# EAGLE design hexagon (EAGLE 9.4.0)

## Sheet 1 of 3: LEDs
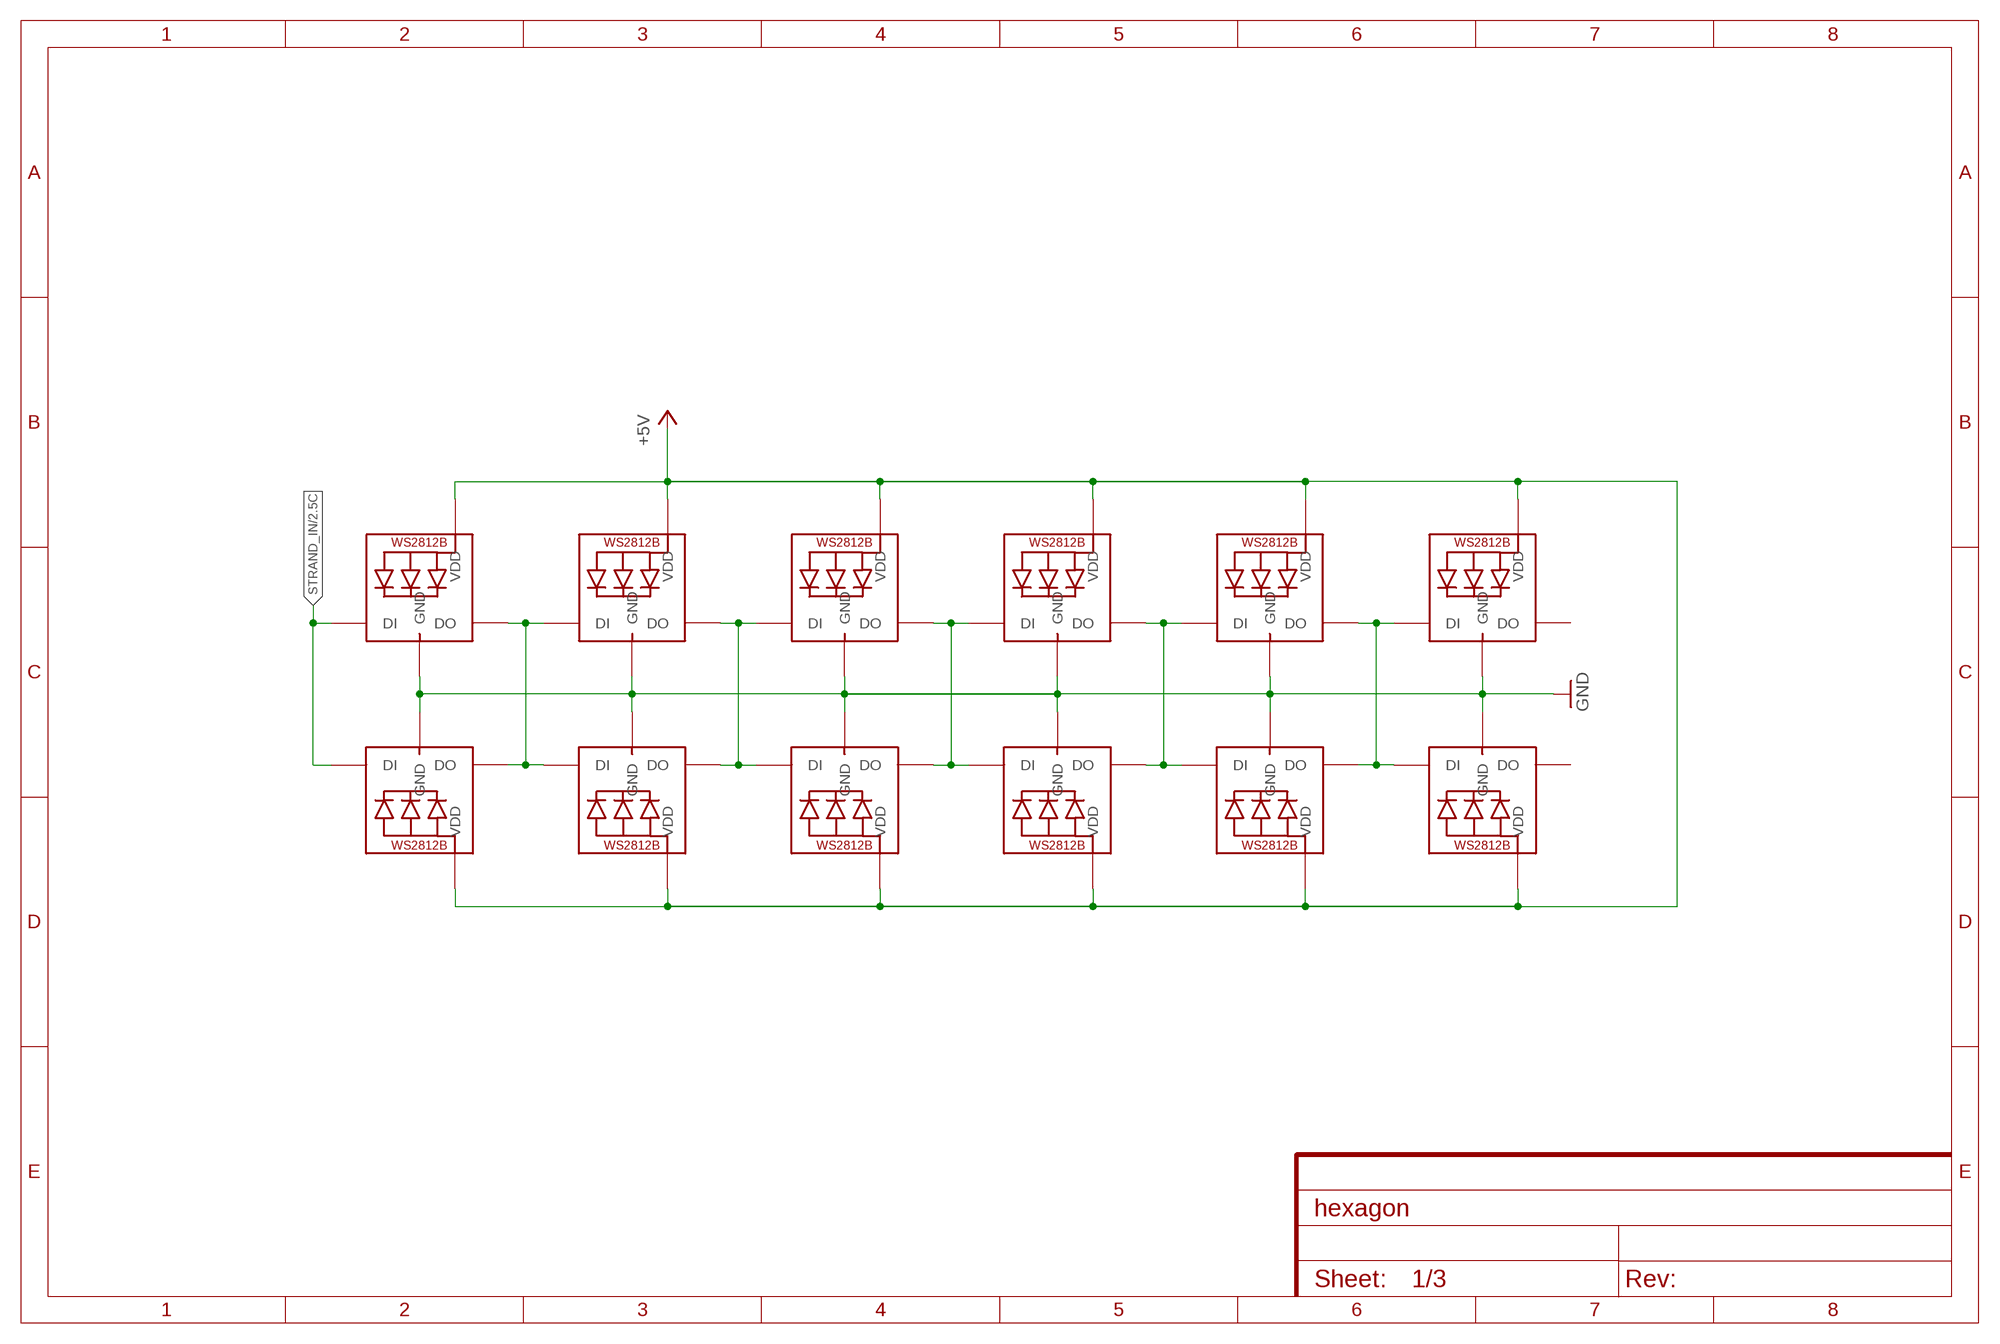
[diagram p0: schematic, sheet 1]

### Parts
LED1  WS2812B5050  [WS2812B]
LED2  WS2812B5050  [WS2812B]
LED3  WS2812B5050  [WS2812B]
LED4  WS2812B5050  [WS2812B]
LED5  WS2812B5050  [WS2812B]
LED6  WS2812B5050  [WS2812B]
LED7  WS2812B3535  [LED3535]
LED8  WS2812B3535  [LED3535]
LED9  WS2812B3535  [LED3535]
LED10  WS2812B3535  [LED3535]
LED11  WS2812B3535  [LED3535]
LED12  WS2812B3535  [LED3535]

### Nets
+5V [power usb]: LED1.1-VDD(VDD) LED2.1-VDD(VDD) LED3.1-VDD(VDD) LED4.1-VDD(VDD) LED5.1-VDD(VDD) LED6.1-VDD(VDD) LED7.2(VDD) LED8.2(VDD) LED9.2(VDD) LED10.2(VDD) LED11.2(VDD) LED12.2(VDD) ; also sheet 2,3
GND: LED1.3-GND(GND) LED2.3-GND(GND) LED3.3-GND(GND) LED4.3-GND(GND) LED5.3-GND(GND) LED6.3-GND(GND) LED7.4(GND) LED8.4(GND) LED9.4(GND) LED10.4(GND) LED11.4(GND) LED12.4(GND) ; also sheet 2,3
N$1: LED1.4-DIN(DI) LED6.2-DOUT(DO) LED7.1(DI) LED12.3(DO)
N$6: LED2.2-DOUT(DO) LED3.4-DIN(DI) LED8.3(DO) LED9.1(DI)
N$8: LED3.2-DOUT(DO) LED4.4-DIN(DI) LED9.3(DO) LED10.1(DI)
N$10: LED4.2-DOUT(DO) LED5.4-DIN(DI) LED10.3(DO) LED11.1(DI)
N$12: LED5.2-DOUT(DO) LED6.4-DIN(DI) LED11.3(DO) LED12.1(DI)
STRAND_IN: LED2.4-DIN(DI) LED8.1(DI) ; also sheet 2
Unconnected: LED1.2-DOUT(DO) LED7.3(DO)

## Sheet 2 of 3: Microcontroller
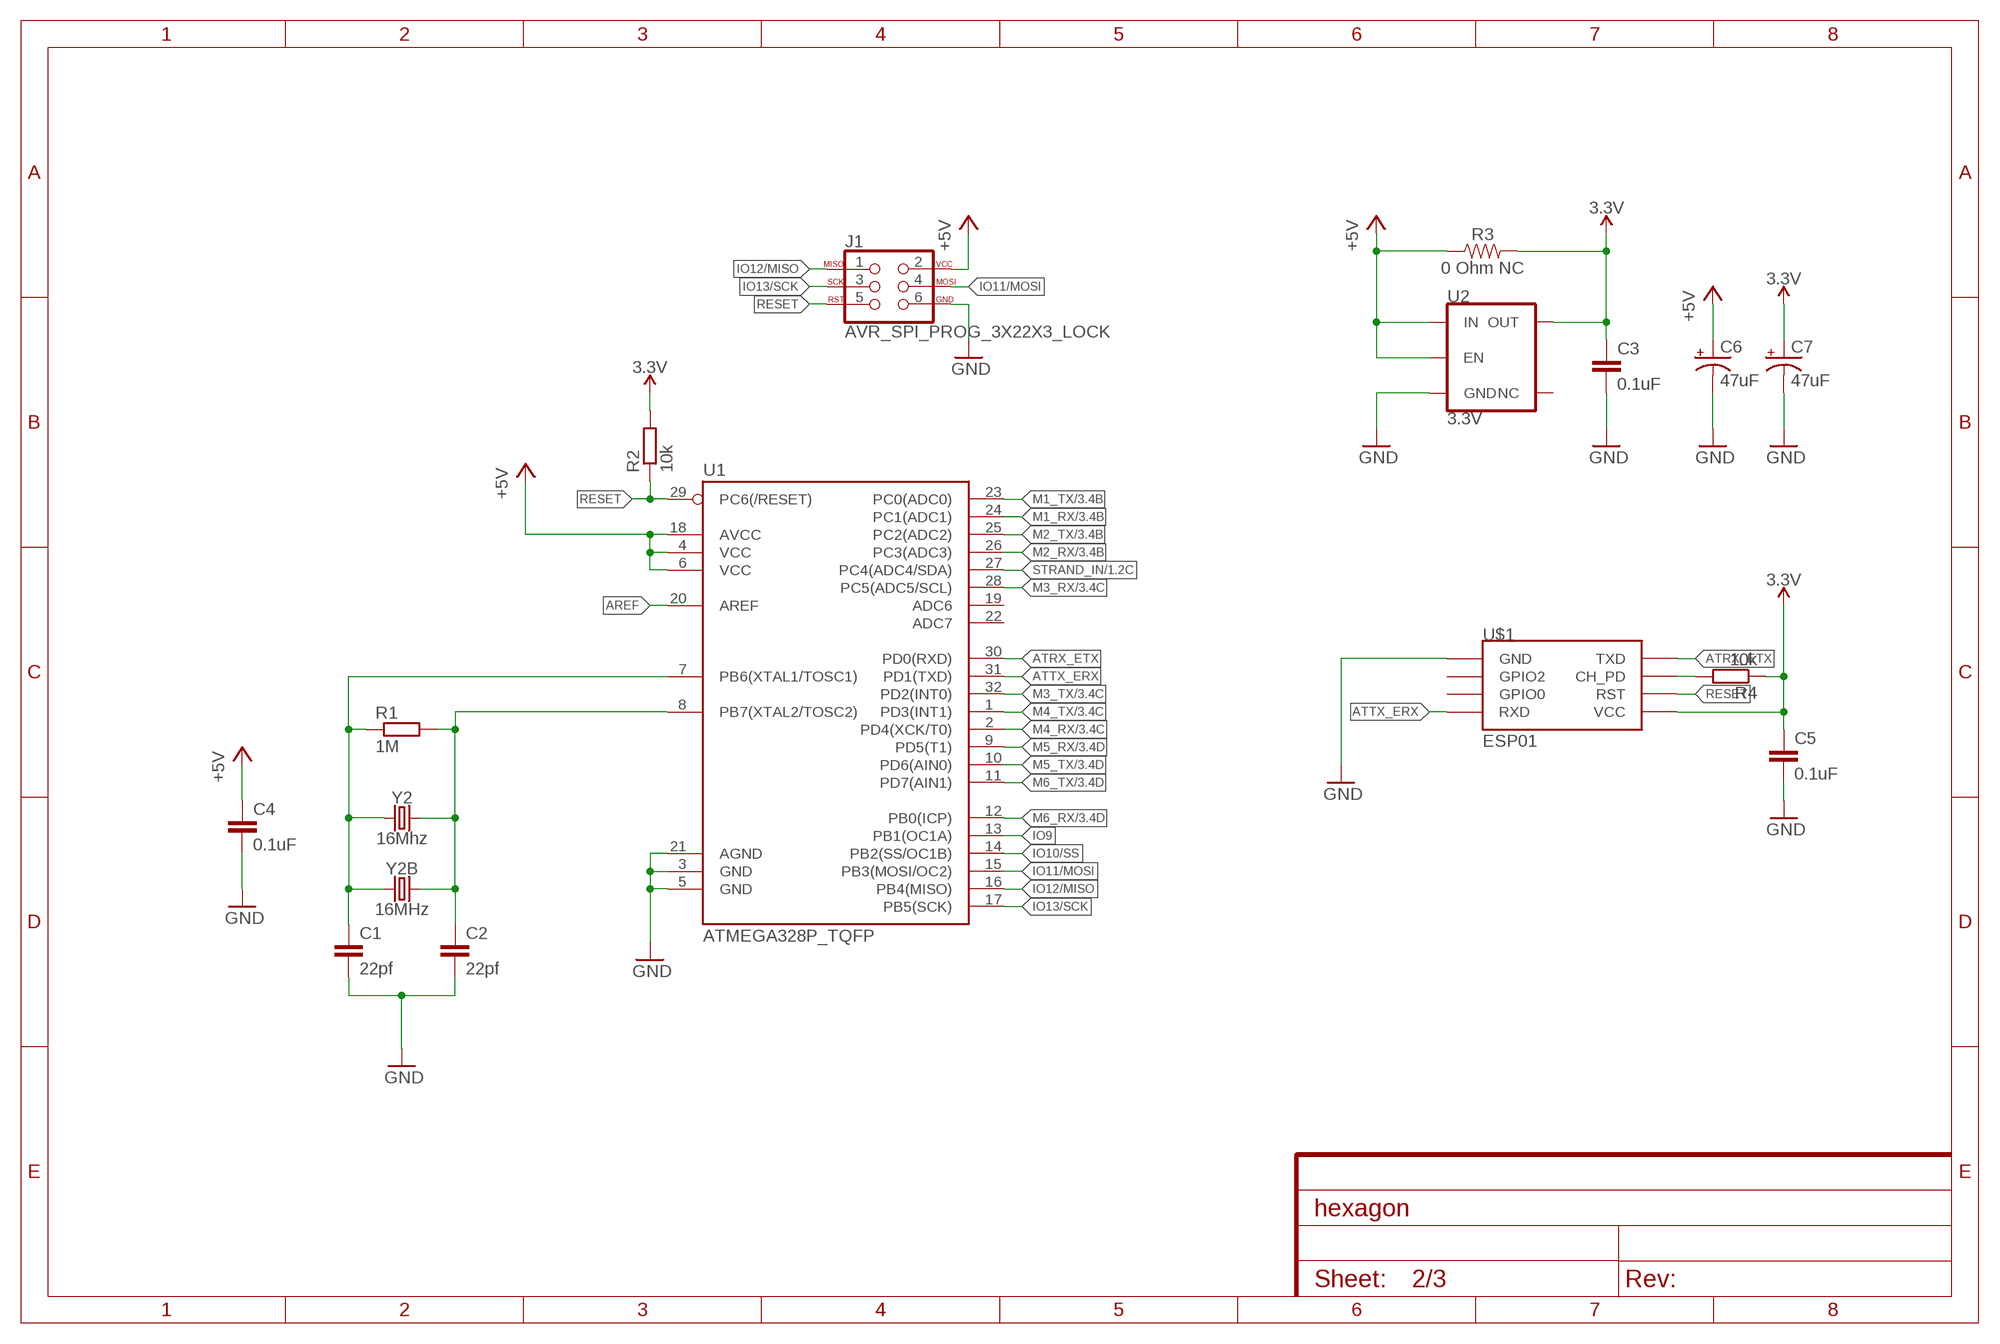
[diagram p1: schematic, sheet 2]

### Parts
C1  22pf  C-EUC0603  [C0603]
C2  22pf  C-EUC0603  [C0603]
C3  0.1uF  C-EUC0603  [C0603]
C4  0.1uF  C-EUC0603  [C0603]
C5  0.1uF  C-EUC0603  [C0603]
C6  47uF  47UF-POLAR-PANASONIC_D-35V-20%  [PANASONIC_D]
C7  47uF  47UF-POLAR-PANASONIC_D-35V-20%  [PANASONIC_D]
J1  AVR_SPI_PROG_3X22X3_LOCK  [2X3_LOCK]
R1  1M  R-EU_R0603  [R0603]
R2  10k  R-EU_R0603  [R0603]
R3  0 Ohm NC  RESISTOR0603  [0603]
R4  10k  R-EU_R0603  [R0603]
U1  ATMEGA328P_TQFP  [TQFP32-08]
U2  3.3V  V_REG_AP2112K-3.3V  [SOT23-5]
U$1  ESP01  [ESP01]
Y2  16Mhz  CRYSTAL-8MHZSMD-HC49UP  [HC49UP]
Y2B  16MHz  CRYSTALPTH-HC49UV  [HC49U]

### Nets
3.3V: C3.1 C5.1 C7.+ R2.2 R3.2 R4.1 U2.5(OUT) U$1.VCC
328_OSC1: C1.1 R1.1 U1.7(PB6(XTAL1/TOSC1)) Y2.1 Y2B.1
328_OSC2: C2.1 R1.2 U1.8(PB7(XTAL2/TOSC2)) Y2.2 Y2B.2
+5V [power usb]: C4.1 C6.+ J1.2 R3.1 U1.4(VCC) U1.6(VCC) U1.18(AVCC) U2.1(IN) U2.3(EN) ; also sheet 1,3
AREF: U1.20(AREF)
ATRX_ETX: U1.30(PD0(RXD)) U$1.TX(TXD)
ATTX_ERX: U1.31(PD1(TXD)) U$1.RX(RXD)
GND: C1.2 C2.2 C3.2 C4.2 C5.2 C6.- C7.- J1.6 U1.3(GND) U1.5(GND) U1.21(AGND) U2.2(GND) U$1.GND ; also sheet 1,3
IO9: U1.13(PB1(OC1A))
IO10/SS: U1.14(PB2(SS/OC1B))
IO11/MOSI: J1.4 U1.15(PB3(MOSI/OC2))
IO12/MISO: J1.1 U1.16(PB4(MISO))
IO13/SCK: J1.3 U1.17(PB5(SCK))
M1_RX: U1.24(PC1(ADC1)) ; also sheet 3
M1_TX: U1.23(PC0(ADC0)) ; also sheet 3
M2_RX: U1.26(PC3(ADC3)) ; also sheet 3
M2_TX: U1.25(PC2(ADC2)) ; also sheet 3
M3_RX: U1.28(PC5(ADC5/SCL)) ; also sheet 3
M3_TX: U1.32(PD2(INT0)) ; also sheet 3
M4_RX: U1.2(PD4(XCK/T0)) ; also sheet 3
M4_TX: U1.1(PD3(INT1)) ; also sheet 3
M5_RX: U1.9(PD5(T1)) ; also sheet 3
M5_TX: U1.10(PD6(AIN0)) ; also sheet 3
M6_RX: U1.12(PB0(ICP)) ; also sheet 3
M6_TX: U1.11(PD7(AIN1)) ; also sheet 3
N$2: R4.2 U$1.CH_PD
RESET: J1.5 R2.1 U1.29(PC6(/RESET)) U$1.RST
STRAND_IN: U1.27(PC4(ADC4/SDA)) ; also sheet 1
Unconnected: U1.19(ADC6) U1.22(ADC7) U2.4(NC) U$1.GPIO0 U$1.GPIO2

## Sheet 3 of 3: Inter-Connectors
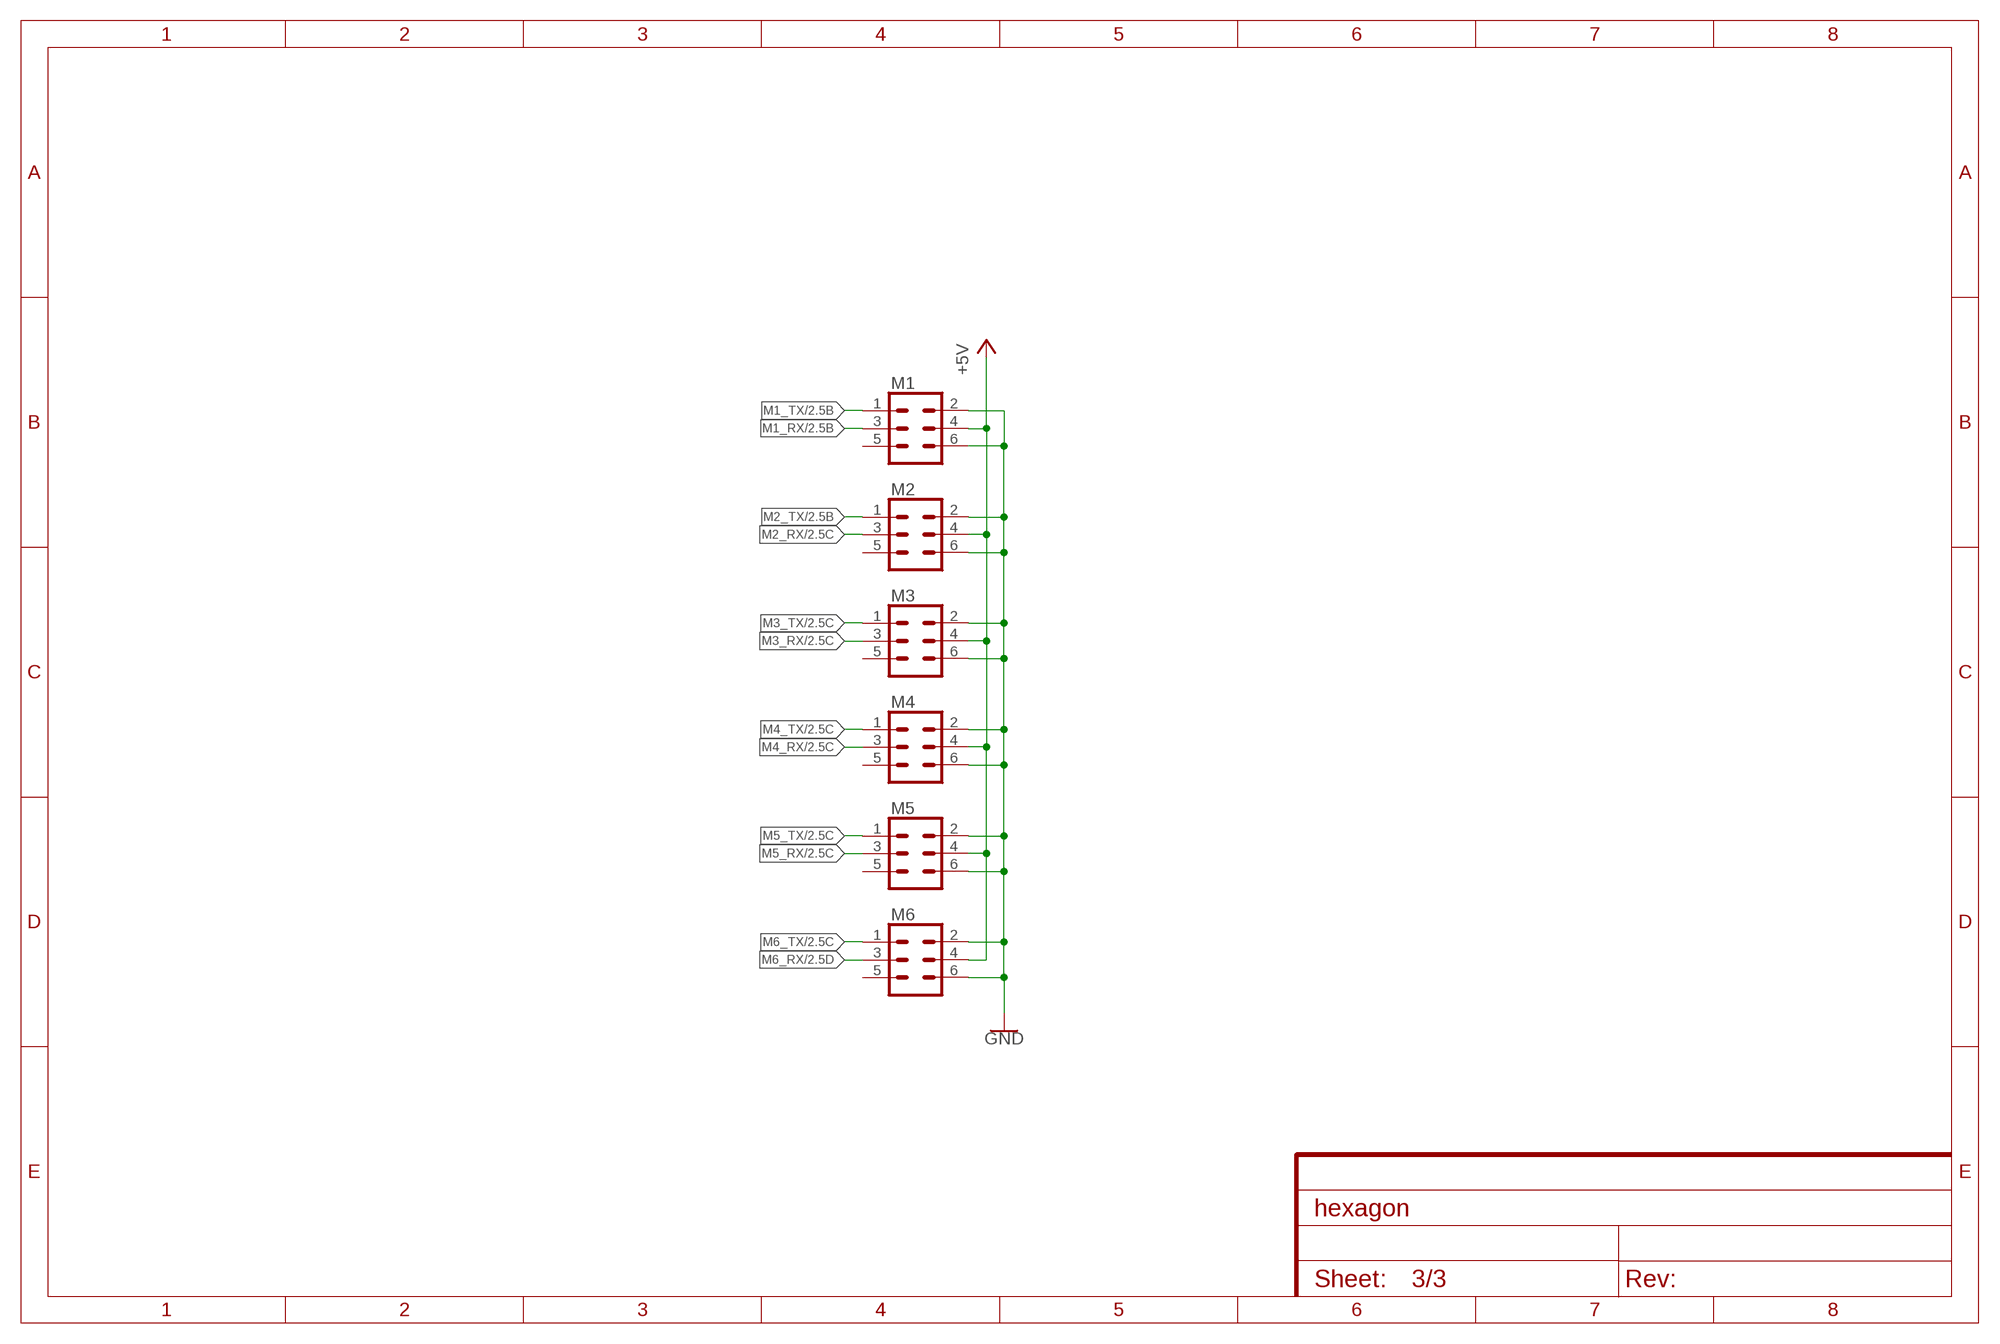
[diagram p2: schematic, sheet 3]

### Parts
M1  CONN_03X2SHROUD  [2X3-SHROUDED]
M2  CONN_03X2SHROUD  [2X3-SHROUDED]
M3  CONN_03X2SHROUD  [2X3-SHROUDED]
M4  CONN_03X2SHROUD  [2X3-SHROUDED]
M5  CONN_03X2SHROUD  [2X3-SHROUDED]
M6  CONN_03X2SHROUD  [2X3-SHROUDED]

### Nets
+5V [power usb]: M1.4 M2.4 M3.4 M4.4 M5.4 M6.4 ; also sheet 1,2
GND: M1.2 M1.6 M2.2 M2.6 M3.2 M3.6 M4.2 M4.6 M5.2 M5.6 M6.2 M6.6 ; also sheet 1,2
M1_RX: M1.3 ; also sheet 2
M1_TX: M1.1 ; also sheet 2
M2_RX: M2.3 ; also sheet 2
M2_TX: M2.1 ; also sheet 2
M3_RX: M3.3 ; also sheet 2
M3_TX: M3.1 ; also sheet 2
M4_RX: M4.3 ; also sheet 2
M4_TX: M4.1 ; also sheet 2
M5_RX: M5.3 ; also sheet 2
M5_TX: M5.1 ; also sheet 2
M6_RX: M6.3 ; also sheet 2
M6_TX: M6.1 ; also sheet 2
Unconnected: M1.5 M2.5 M3.5 M4.5 M5.5 M6.5

## Library data of the parts
C1-C5 = rcl:C-EU: CAPACITOR, European symbol; SPICEPREFIX: C
C6 C7 = SparkFun-Capacitors:47UF-POLAR: 47µF polarized capacitors A capacitor is a passive two-terminal electrical component used to store electrical energy temporarily in an electric field.; PROD_ID: CAP-08478
J1 = SparkFun-Connectors:AVR_SPI_PROG_3X2: AVR ISP 6 Pin This is the reduced ISP connector for AVR programming. Common on Arduino. This footprint will take up less PCB space and can be used with a 10-pin to 6-pin adapter such as SKU: BOB-08508 **Special note about "TEST_POINT" package. The stop mask is on the top side, so if you want your programming test points to be on the bottom of your board, make sure to place this package on the bottom side of the board. This also ensure that the orientation to program from the bottom side will be correct. SparkFun Products: SparkFun ISP Pogo Adapter <https://www.sparkfun.com/products/11591> - NS Tiny AVR Programmer <https://www.sparkfun.com/products/11801> -PTH
LED1-LED12 = adafruit:WS2812B
M1-M6 = SparkFun-Connectors:CONN_03X2: Multi connection point. Often used as Generic Header-pin footprint for 0.1 inch spaced/style header connections You can populate with any combo of single row headers, but if you'd like an exact match, check these: Header - 2x3 (Male, 0.1") <https://www.sparkfun.com/products/12807> (PRT-12807) Header - 2x3 (Female, 0.1") <https://www.sparkfun.com/products/13010> (PRT-13010) 2x3 Pin Shrouded Header <https://www.sparkfun.com/products/10877> (PRT-10877) On any of the 0.1 inch spaced packages, you can populate with these: Break Away Headers - Straight <https://www.sparkfun.com/products/116> (PRT-00116) Break Away Male Headers - Right Angle <https://www.sparkfun.com/products/553> (PRT-00553) Female Headers <https://www.sparkfun.com/products/115> (PRT-00115) Break Away Headers - Machine Pin <https://www.sparkfun.com/products/117> (PRT-00117) Break Away Female Headers - Swiss Machine Pin <https://www.sparkfun.com/products/743> (PRT-00743) Special note: the shrouded connector mates well with our 3x2 ribbon cables: Ribbon Crimp Connector - 6-pin (2x3, Female) <https://www.sparkfun.com/products/10651> (PRT-10651) Ribbon Cable - 6 wire (15ft) <https://www.sparkfun.com/products/10646> (PRT-10646); PROD_ID: CONN-10681; SF_ID: PRT_10877
R1 R2 R4 = rcl:R-EU_: RESISTOR, European symbol; SPICEPREFIX: R
R3 = SparkFun-Resistors:RESISTOR: Generic Resistor Package
U1 = SparkFun-IC-Microcontroller:ATMEGA328P_TQFP: Popular 328P in QFP Storefront component: ATmega328 - TQFP <https://www.sparkfun.com/products/13448> (COM-13448) Datasheet <http://www.sparkfun.com/datasheets/Components/SMD/ATMega328.pdf> SparkFun Products SparkFun RedBoard - Programmed with Arduino <https://www.sparkfun.com/products/12757> (DEV-12757) Arduino Pro Mini 328 - 5V/16MHz <https://www.sparkfun.com/products/11113> (DEV-11113) Arduino Pro Mini 328 - 3.3V/8MHz <https://www.sparkfun.com/products/11114> (DEV-11114) SparkFun OpenLog <https://www.sparkfun.com/products/13712> (DEV-13712) SparkFun MicroView - OLED Arduino Module <https://www.sparkfun.com/products/12923> (DEV-12923) SparkFun Digital Sandbox <https://www.sparkfun.com/products/12651> (DEV-12651) SparkFun PicoBoard <https://www.sparkfun.com/products/11888> (WIG-11888) Arduino Fio <https://www.sparkfun.com/products/10116> (DEV-10116) LilyPad Arduino 328 Main Board <https://www.sparkfun.com/products/13342> (DEV-13342) SparkFun RedStick <https://www.sparkfun.com/products/13741> (DEV-13741) LilyPad MP3 <https://www.sparkfun.com/products/11013> (DEV-11013) LilyPad Arduino SimpleSnap <https://www.sparkfun.com/products/10941> (DEV-10941) SparkFun Stepoko <https://www.sparkfun.com/products/13899> (ROB-13899) SparkFun Geiger Counter <https://www.sparkfun.com/products/11345> (SEN-11345) SparkFun EL Sequencer <https://www.sparkfun.com/products/12781> (COM-12781) Arduino Pro 328 - 5V/16MHz <https://www.sparkfun.com/products/10915> (DEV-10915) CryptoCape <https://www.sparkfun.com/products/12773> (DEV-12773) SparkFun IR Thermometer Evaluation Board - MLX90614 <https://www.sparkfun.com/products/10740> (SEN-10740) SparkFun RedBot Mainboard <https://www.sparkfun.com/products/12097> (ROB-12097) Arduino Pro 328 - 3.3V/8MHz <https://www.sparkfun.com/products/10914> (DEV-10914) SparkFun Block for Intel® Edison - Arduino <https://www.sparkfun.com/products/13036> (DEV-13036) SparkFun Simon Says - Surface Mount Soldering Kit <https://www.sparkfun.com/products/10935> (KIT-10935) SparkFun 7-Segment Serial Display - Red <https://www.sparkfun.com/products/11441> (COM-11441) SparkFun 7-Segment Serial Display - White <https://www.sparkfun.com/products/11629> (COM-11629) SparkFun 7-Segment Serial Display - Yellow <https://www.sparkfun.com/products/11443> (COM-11443) SparkFun 7-Segment Serial Display - Kelly Green <https://www.sparkfun.com/products/11440> (COM-11440) SparkFun 7-Segment Serial Display - Blue <https://www.sparkfun.com/products/11442> (COM-11442) SparkFun OpenSegment Serial Display - 20mm (Blue) <https://www.sparkfun.com/products/11647> (COM-11647) SparkFun OpenSegment Serial Display - 20mm (Green) <https://www.sparkfun.com/products/11646> (COM-11646) SparkFun OpenSegment Serial Display - 20mm (White) <https://www.sparkfun.com/products/11648> (COM-11648) SparkFun OpenSegment Serial Display - 20mm (Red) <https://www.sparkfun.com/products/11644> (COM-11644) SparkFun OpenSegment Serial Display - 20mm (Yellow) <https://www.sparkfun.com/products/11645> (COM-11645) SparkFun OpenSegment Shield <https://www.sparkfun.com/products/13190> (DEV-13190); PROD_ID: IC-09069
U2 = SparkFun-IC-Power:V_REG_AP2112: AP2112 - 600mA CMOS LDO Regulator w/ Enable The AP2112 is CMOS process low dropout linear regulator with enable function, the regulator delivers a guaranteed 600mA (min.) continuous load current. Features Output Voltage Accuracy: ±1.5% Output Current: 600mA (Min.) Foldback Short Current Protection: 50mA Enable Function to Turn ON/OFF VOUT Low Dropout Voltage (3.3V): 250mV (Typ.) @IOUT=600mA Excellent Load Regulation: 0.2%/A (Typ.) Excellent Line Regulation: 0.02%/V (Typ.) Low Quiescent Current: 55μA (Typ.) Low Standby Current: 0.01μA (Typ.) Low Output Noise: 50μVRMS PSRR: 100Hz -65dB, 1kHz -65dB OTSD Protection Stable with 1.0μF Flexible Cap: Ceramic, Tantalum and Aluminum Electrolytic Operation Temperature Range: -40°C to 85°C ESD: MM 400V, HBM 4000V; PROD_ID: VREG-12457
U$1 = esp8266modules:ESP01: ESP8266 Wifi module 01
Y2 = SparkFun-Clocks:CRYSTAL-8MHZ: 8MHz Crystal Datasheet Example <http://www.futureelectronics.com/en/technologies/electromechanical/timing-devices/crystals/Pages/6008189-ABM3B-8.000MHZ-B2-T.aspx?IM=0> Frequency: 8MHz Frequency Tolerance: ±20ppm Load Capacitance: 18pF SparkFun Products: Pro Micro -3.3V/8MHz <https://www.sparkfun.com/products/12587> WAV Trigger <https://www.sparkfun.com/products/13660>; PROD_ID: XTAL-11706; VALUE: 8MHz
Y2B = SparkFun-Clocks:CRYSTAL: Crystals (Generic) These are passive quartz crystals, which can be used as a clock source for a microcontroller. Crystal's are two-terminal devices. They require external "load" capacitors to generate an oscillating signal.

## Net classes
0 default: width 0.203 mm
2 gnd: width 0.305 mm, clearance 0.203 mm
3 power usb: width 0.305 mm, clearance 0.203 mm

## Board
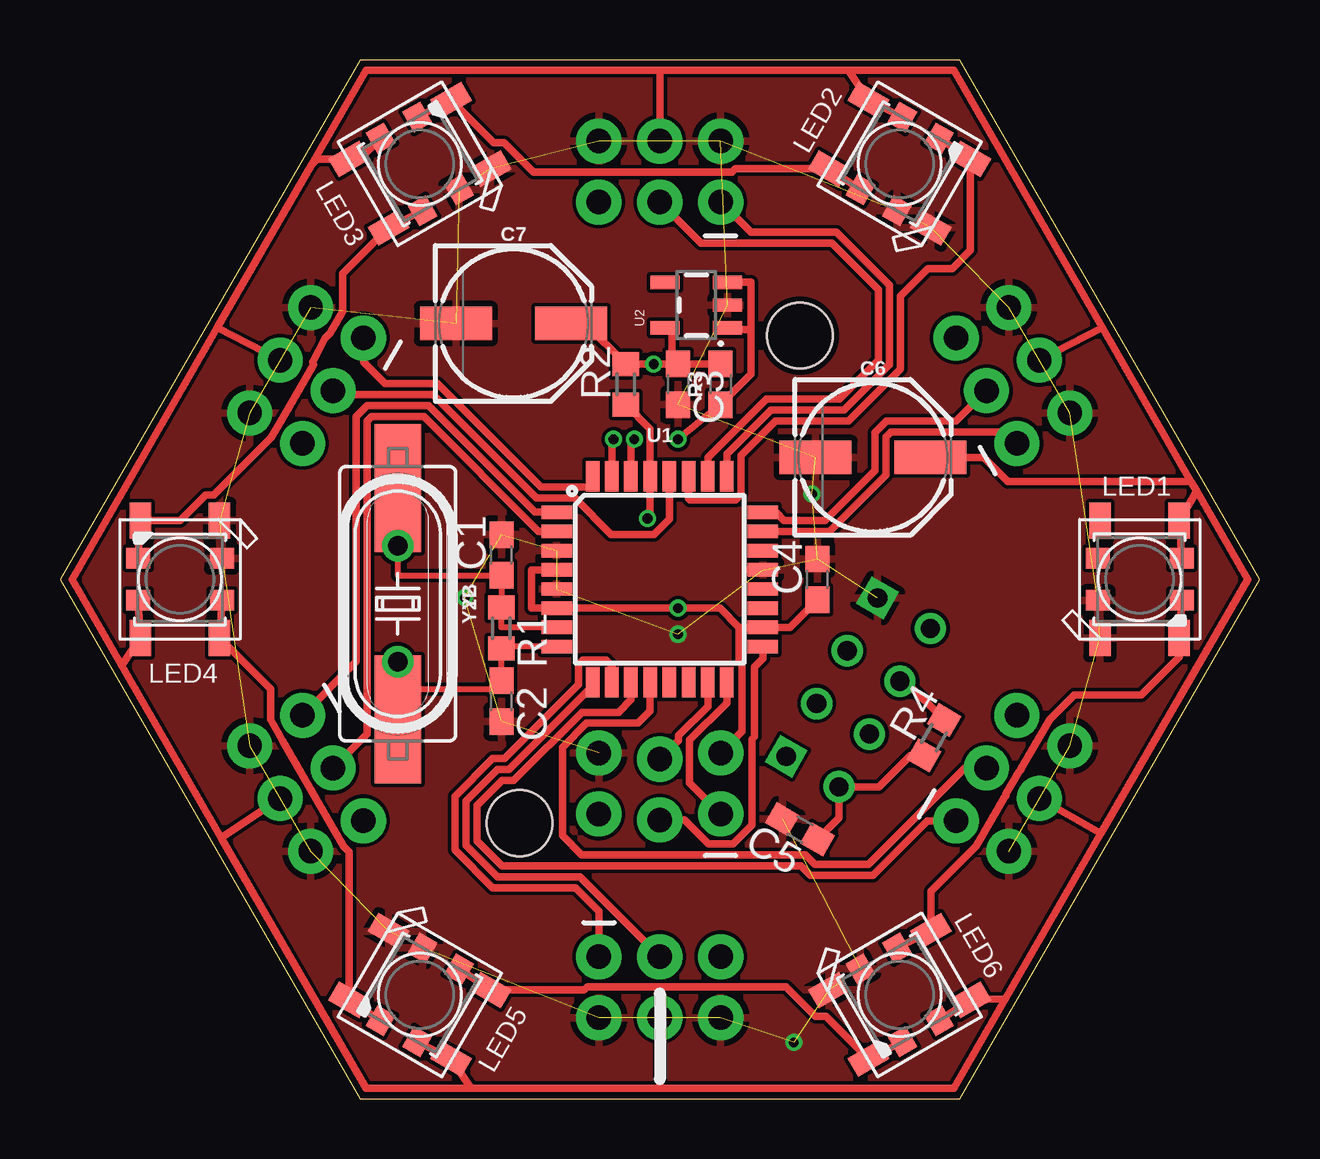
[diagram p3: board, top side]
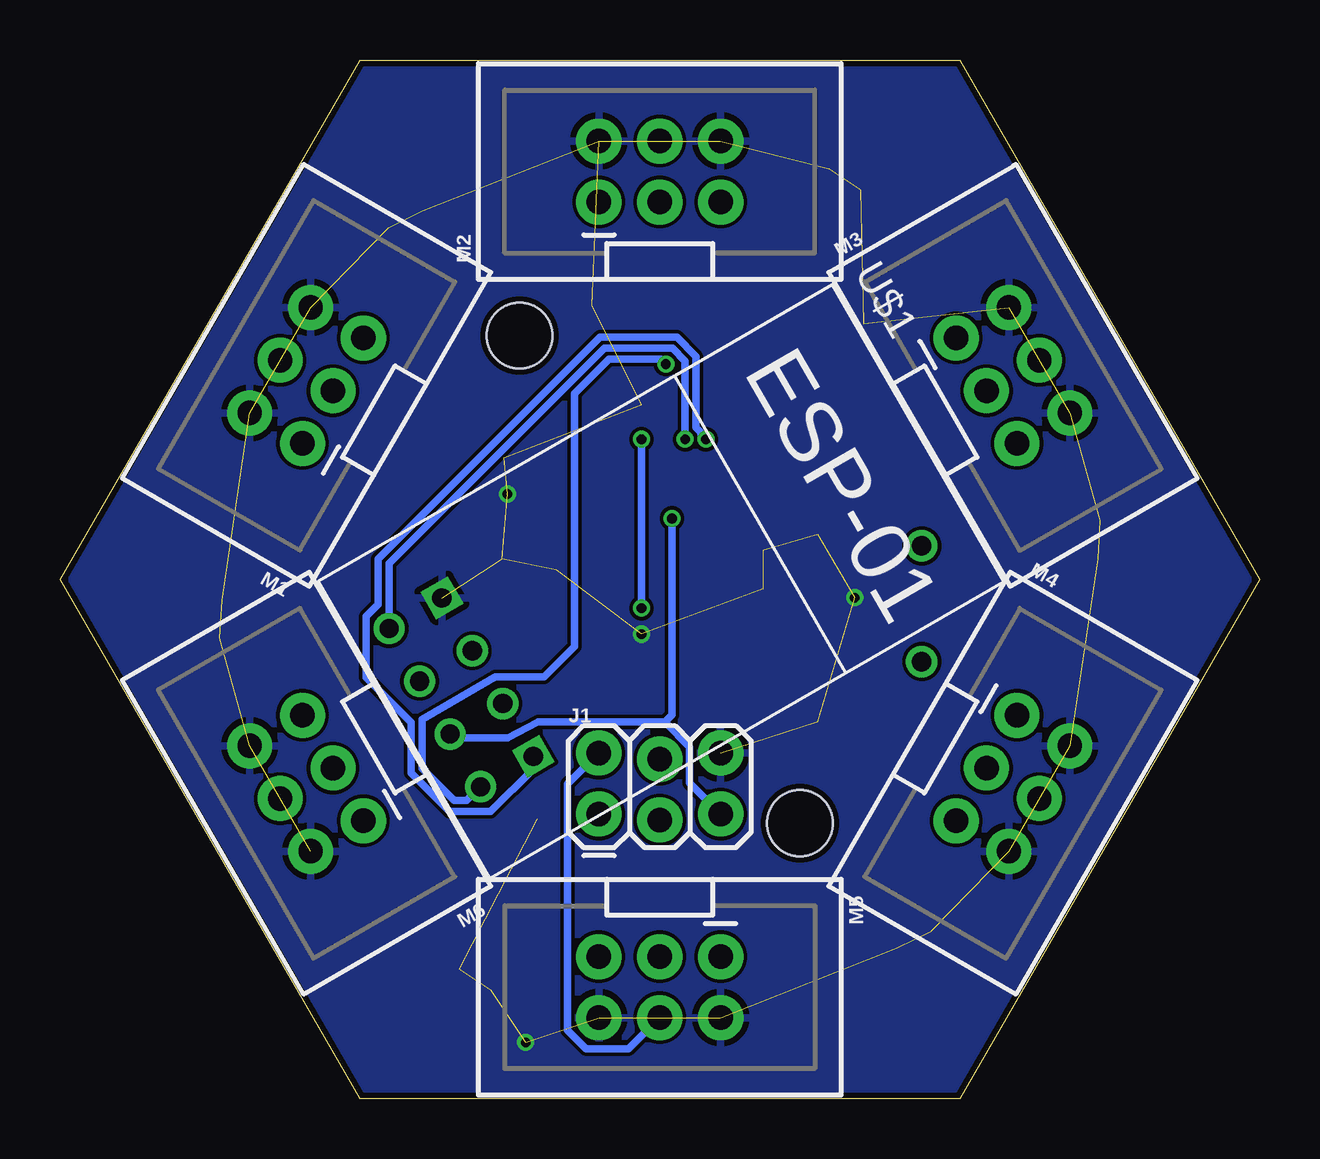
[diagram p4: board, bottom side, seen from below]

Size 50 x 43.3 mm. Coordinates in mm from the lower left corner, seen from the top.
Outline: 37.5,43.3 12.5,43.3 0,21.65 12.5,0 37.5,0 50,21.65 37.5,43.3
Copper layers (1*16): Top 0.035mm / dielectric 1.5mm / Bottom 0.035mm
Design rules "dirtypcbs": minimum track width 6mil, minimum drill 12mil, track to track 6mil, track to pad 6mil, pad to pad 6mil, via to via 6mil, smd to smd 0mil, copper to edge 10mil, drill to drill 10mil, minimum pad ring 10mil, minimum via ring 6mil, stop-mask expansion 2mil, vias tented up to drill 25mil, thermal gap 10mil
Holes 2.75 mm at 30.84,31.81 19.16,11.49

### Footprints (pad centres in the part's own frame; a part is rotated, then mirrored left to right if it is on the bottom)
C0603 = smd 1.1 x 1: 1 -0.85,0; 2 0.85,0
PANASONIC_D = smd 3 x 1.4: + 2.4,0; - -2.4,0
2X3_LOCK = drill 1.016 pad 1.88: 1 0,0.127; 2 0,2.667; 3 2.54,-0.127; 4 2.54,2.413; 5 5.08,0.127; 6 5.08,2.667
WS2812B = smd 1.5 x 0.9: 1-VDD 2.45,-1.65; 2-DOUT 2.45,1.65; 3-GND -2.45,1.65; 4-DIN -2.45,-1.65
LED3535 = smd 1 x 0.85: 1 -1.75,0.875; 2 -1.75,-0.875; 3 1.75,-0.875; 4 1.75,0.875
2X3-SHROUDED = drill 1.016 pad 1.88: 1 -1.27,2.54; 2 1.27,2.54; 3 -1.27,0; 4 1.27,0; 5 -1.27,-2.54; 6 1.27,-2.54
R0603 = smd 1 x 1.1: 1 -0.85,0; 2 0.85,0
0603 = smd 1.1 x 1: 1 -0.85,0; 2 0.85,0
TQFP32-08 = smd 1.27 x 0.559: 1 -4.293,2.8; 2 -4.293,2; 3 -4.293,1.2; 4 -4.293,0.4; 5 -4.293,-0.4; 6 -4.293,-1.2; 7 -4.293,-2; 8 -4.293,-2.8; 17 4.293,-2.8; 18 4.293,-2; 19 4.293,-1.2; 20 4.293,-0.4; 21 4.293,0.4; 22 4.293,1.2; 23 4.293,2; 24 4.293,2.8 | smd 0.559 x 1.27: 9 -2.8,-4.293; 10 -2,-4.293; 11 -1.2,-4.293; 12 -0.4,-4.293; 13 0.4,-4.293; 14 1.2,-4.293; 15 2,-4.293; 16 2.8,-4.293; 25 2.8,4.293; 26 2,4.293; 27 1.2,4.293; 28 0.4,4.293; 29 -0.4,4.293; 30 -1.2,4.293; 31 -2,4.293; 32 -2.8,4.293
SOT23-5 = smd 0.55 x 1.2: 1 -0.95,-1.3; 2 0,-1.3; 3 0.95,-1.3; 4 0.95,1.3; 5 -0.95,1.3
ESP01 = drill 0.8: CH_PD -1.285,-8.178; GPIO0 1.255,-5.638; GPIO2 -1.285,-5.638; RST 1.255,-8.178; TX -3.825,-8.178; VCC 3.795,-8.178 | drill 0.8 square: GND -3.825,-5.638; RX 3.795,-5.638
HC49UP = smd 5.334 x 1.93: 1 -4.826,0; 2 4.826,0
HC49U = drill 0.813: 1 -2.413,0; 2 2.413,0

### Placement (x,y rotation side)
C1  18.4,22.67 90 top
C2  18.4,16.57 270 top
C3  25.76,29.78 270 top
C4  31.57,21.65 90 top
C5  30.84,11.24 150 top
C6  33.89,26.73 0 top
C7  18.9,32.32 0 top
J1  27.54,11.74 0 bottom
LED1  45,21.65 90 top
LED2  35,38.97 150 top
LED3  15,38.97 210 top
LED4  5,21.65 270 top
LED5  15,4.33 330 top
LED6  35,4.33 30 top
LED7  45,21.65 180 top
LED8  35,38.97 240 top
LED9  15,38.97 300 top
LED10  5,21.65 0 top
LED11  15,4.33 60 top
LED12  35,4.33 120 top
M1  39.72,30.15 150 bottom
M2  25,38.65 90 bottom
M3  10.28,30.15 30 bottom
M4  10.28,13.15 330 bottom
M5  25,4.65 270 bottom
M6  39.72,13.15 210 bottom
R1  18.4,19.62 270 top
R2  23.58,29.78 90 top
R3  27.54,29.78 90 top
R4  36.43,15.05 60 top
U1  25,21.65 0 top
U2  26.52,33.08 90 top
U$1  27.29,20.38 300 bottom
Y2  14.08,20.63 270 top
Y2B  14.08,20.63 270 top

### Tracks (layer width: path | path; a pad name or v marks a point on that pad's centre or on a via)
3.3V  (via drill 0.41)
  Top 0.305: R2.2 v24.75,30.63 25.51,30.63 | 25.51,30.63 C3.1 R3.2 | R2.2 23.72,30.63 | C7.+ 21.89,32.32 R2.2 | U2.5 25.51,32.13 25.51,30.63 | C5.1 32.47,11.7 U$1.VCC 34.13,13.01 35.44,14.31 R4.1
  Bottom 0.305: v24.75,30.63 24.95,30.83 27.11,30.83 28.56,29.39 28.56,18.86 29.83,17.59 31.86,17.59 34.91,15.81 34.91,13.78 33.56,12.43 33.04,12.43 U$1.VCC
328_OSC1
  Top 0.254: U1.7 18.4,19.65 R1.1 C1.1 14.08,21.82 Y2.1 Y2B.1
328_OSC2
  Top 0.254: Y2B.2 Y2.2 14.08,17.08 18.4,17.08 C2.1 R1.2 18.4,18.85 U1.8
+5V  (via drill 0.41)
  Top 0.305: 17.13,0.43 12.75,0.43 6.72,10.88 | 17.13,0.43 25,0.43 | 25,0.43 37.25,0.43 39.41,4.17 | 6.72,10.88 2.58,18.05 | 2.58,18.05 0.5,21.65 6.56,32.15 | 10.48,38.94 12.75,42.87 25,42.87 | 10.48,38.94 6.56,32.15 | 25,42.87 32.87,42.87 | 32.87,42.87 37.25,42.87 43.44,32.15 | 39.41,4.17 43.39,11.07 | 43.39,11.07 49.5,21.65 47.38,25.33 | 43.44,32.15 47.14,25.74 | 47.14,25.74 47.38,25.33 | LED7.2 LED1.1-VDD 47.38,25.33 | LED12.2 LED6.1-VDD 39.41,4.17 | LED11.2 LED5.1-VDD 17.13,0.43 | LED10.2 LED4.1-VDD 2.58,18.05 | LED8.2 LED2.1-VDD 32.87,42.87 | M3.4 6.56,32.15 | M4.4 6.72,10.88 | M5.4 25,0.43 | M6.4 43.39,11.07 | M1.4 43.44,32.15 | M2.4 25,42.87 | U1.4 19.67,22.05 19.67,20.45 U1.6 v25.76,20.45 27.5,20.45 28.3,19.65 | 28.3,19.65 U1.18 30.42,19.65 C4.1 | J1.2 28.43,15.31 28.43,18.14 28.3,18.27 28.3,19.65 | C6.+ 38.51,26.73 39.5,25.74 47.14,25.74 | 27.73,34.13 U2.3 28.81,34.03 28.81,32.06 | 28.81,32.06 27.82,32.06 U2.1 | 28.81,32.06 28.81,30.2 R3.1 v25.76,27.49 | 12.01,39.13 LED3.1-VDD | LED9.2 12.49,39.17 LED3.1-VDD | LED3.1-VDD 10.71,39.17 10.48,38.94
  Bottom 0.305: v25.76,27.49 v25.76,20.45 | M5.4 26.3,2.09 28.08,2.09 28.84,2.84 28.84,13.12 J1.2
ATRX_ETX  (via drill 0.41)
  Top 0.305: U1.30 23.8,27.35 v23.94,27.49
  Bottom 0.305: U$1.TX 36.28,22.31 27.3,31.29 24.47,31.29 23.94,30.76 v23.94,27.49
ATTX_ERX  (via drill 0.41)
  Top 0.305: U1.31 23,27.42 v23.08,27.49
  Bottom 0.305: v23.08,27.49 23.28,27.7 23.28,27.77 23.48,27.97 23.48,30.95 24.28,31.75 27.49,31.75 36.74,22.5 36.74,20.6 37.25,20.09 37.25,17.57 35.36,15.68 35.36,13.59 33.75,11.98 32.04,11.98 30.27,13.75 U$1.RX
GND  (via drill 0.41)  (40 unrouted)
  other vias: 25.76,19.36 30.59,2.35 31.35,25.21 16.87,20.89
  pour Top: 52.5,21.65 38.75,45.47 11.25,45.47 -2.5,21.65 11.25,-2.17 38.75,-2.17
  pour Bottom: 52.5,21.65 38.75,45.47 11.25,45.47 -2.5,21.65 11.25,-2.17 38.75,-2.17
IO11/MOSI
  Top 0.305: U1.15 27,16.35 25.79,15.14 25.79,14.94 J1.4
IO12/MISO
  Top 0.305: U1.16 27.8,16.5 26.25,14.95 26.25,13.17 J1.1
IO13/SCK
  Top 0.305: J1.3 26.03,11.62 27.02,10.63 28.06,10.63 28.84,11.41 28.84,14.99 28.94,15.1 28.94,18 29.29,18.35 U1.17
M1_RX
  Top 0.305: U1.24 29.84,24.45 30.18,24.11 31.89,24.11 33.98,26.19 33.98,27.77 34.45,28.24 37.35,28.24 M1.3
M1_TX
  Top 0.305: U1.23 32.08,23.65 34.43,26 34.43,27.58 34.64,27.79 39.42,27.79 M1.1
M2_RX
  Top 0.305: U1.26 27,26.72 29.45,29.17 32.49,29.17 34.12,30.79 34.12,33.73 32.18,35.67 26.71,35.67 M2.3
M2_TX
  Top 0.305: U1.25 27.8,26.88 29.64,28.71 32.69,28.71 34.58,30.6 34.58,33.92 32.37,36.13 28.79,36.13 M2.1
M3_RX
  Top 0.305: M3.3 11.55,29.35 15.55,29.35 19.86,25.03 21.47,25.03 22.97,23.53 24.77,23.53 25.4,24.16 U1.28
M3_TX
  Top 0.305: M3.1 12.65,30.7 13.54,29.8 15.74,29.8 20.05,25.49 22.2,25.49 U1.32
M4_RX
  Top 0.305: U1.2 19.95,23.65 15.17,28.43 12.99,28.43 12.81,28.25 12.81,15.22 M4.3
M4_TX
  Top 0.305: U1.1 19.8,24.45 15.36,28.89 12.8,28.89 12.35,28.44 12.35,18.23 M4.1
M5_RX
  Top 0.305: M5.3 21.67,9.25 18.23,9.25 16.92,10.56 16.92,12.42 18.23,13.73 18.72,13.73 22.2,17.2 U1.9
M5_TX
  Top 0.305: U1.10 23,18.06 22.77,18.3 21.79,18.3 21.62,18.12 21.62,17.27 18.54,14.19 18.04,14.19 16.46,12.61 16.46,10.37 18.04,8.79 21.48,8.79 22.46,7.81 M5.1
M6_RX
  Top 0.305: U1.12 24.6,16.17 24.09,15.66 21.94,15.66 20.94,14.65 20.94,10.98 21.75,10.17 31.08,10.17 31.47,9.78 33.7,9.78 37.71,13.79 M6.3
M6_TX
  Top 0.305: U1.11 23.8,16.64 23.27,16.11 21.75,16.11 18.91,13.27 18.42,13.27 17.38,12.23 17.38,10.75 18.42,9.71 19.9,9.71 30.89,9.71 31.28,9.32 33.89,9.32 36.16,11.59 M6.1
N$1
  Top 0.305: LED12.3 LED6.2-DOUT 36.3,8.64 38.17,10.52 38.27,10.69 39.37,12.57 39.43,12.63 39.43,12.7 39.97,13.63 40.05,13.71 40.05,13.74 41.26,15.81 42.27,16.82 45.07,16.82 46.65,18.41 LED1.4-DIN LED7.1
N$2
  Top 0.305: U$1.CH_PD 35.23,17.4 R4.2
N$6
  Top 0.305: LED8.3 LED2.2-DOUT 28.15,38.77 28,38.63 19.74,38.63 18.51,39.86 18.06,39.86 LED3.4-DIN LED9.1
N$8
  Top 0.305: LED9.3 LED3.2-DOUT 11.78,34.4 11.78,32.81 11.27,31.92 11.06,31.71 10.54,30.71 10.57,30.6 10.03,29.67 9.11,28.08 8.81,27.56 6.41,25.16 6.07,25.16 5.02,24.1 LED4.4-DIN LED10.1
N$10
  Top 0.305: LED10.3 LED4.2-DOUT 8.77,17.08 8.77,15.81 9.29,14.92 11.31,11.41 11.83,10.52 12.05,10.29 LED5.4-DIN LED11.1
N$12
  Top 0.305: LED11.3 LED5.2-DOUT 21.85,4.53 22,4.68 30.26,4.68 31.49,3.44 31.94,3.44 LED6.4-DIN LED12.1
RESET  (via drill 0.41)
  Top 0.305: R2.1 24.6,27.91 U1.29 24.6,24.3 v24.49,24.19
  Bottom 0.305: J1.5 23.75,13.17 23.75,14.67 24.79,15.71 | 24.79,15.71 30.08,15.71 31.35,15.05 33.58,15.05 U$1.RST | v24.49,24.19 24.49,16 24.79,15.71
STRAND_IN
  Top 0.305: LED8.1 37.77,39.29 | 37.77,39.29 LED2.4-DIN | U1.27 26.2,25.02 26.27,24.95 28.16,24.95 28.38,25.18 28.38,26.81 29.83,28.25 32.87,28.25 35.03,30.41 35.03,33.46 36.18,34.6 37.19,34.6 37.95,35.37 37.95,39.11 37.77,39.29